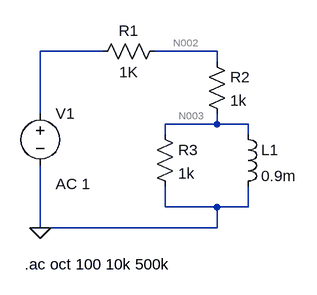
[diagram p0: schematic Draft1.asc]
Draft1.asc, the LTspice schematic file:
Version 4
SHEET 1 880 680
WIRE 80 96 -16 96
WIRE 256 96 160 96
WIRE 256 112 256 96
WIRE -16 192 -16 96
WIRE 256 208 256 192
WIRE 256 208 176 208
WIRE 304 208 256 208
WIRE 176 224 176 208
WIRE 304 224 304 208
WIRE 176 336 176 304
WIRE 256 336 176 336
WIRE 304 336 304 304
WIRE 304 336 256 336
WIRE -16 368 -16 272
WIRE 256 368 256 336
WIRE 256 368 -16 368
FLAG -16 368 0
SYMBOL res 64 112 R270
WINDOW 0 32 56 VTop 2
WINDOW 3 0 56 VBottom 2
SYMATTR InstName R1
SYMATTR Value 1K
SYMBOL res 240 96 R0
SYMATTR InstName R2
SYMATTR Value 1k
SYMBOL res 160 208 R0
SYMATTR InstName R3
SYMATTR Value 1k
SYMBOL ind 288 208 R0
SYMATTR InstName L1
SYMATTR Value 0.9m
SYMBOL voltage -16 176 R0
WINDOW 123 24 124 Left 2
WINDOW 39 0 0 Left 0
SYMATTR InstName V1
SYMATTR Value ""
SYMATTR Value2 AC 1
TEXT -40 424 Left 2 !.ac oct 100 10k 500k

The netlist it stands for:
* Draft1.asc
R1 N001 N002 1K
R2 N002 N003 1k
R3 N003 0 1k
L1 N003 0 0.9m
V1 N001 0 AC 1
.ac oct 100 10k 500k
.backanno
.end

* Results of the author's LTspice run, read from the files saved beside the schematic
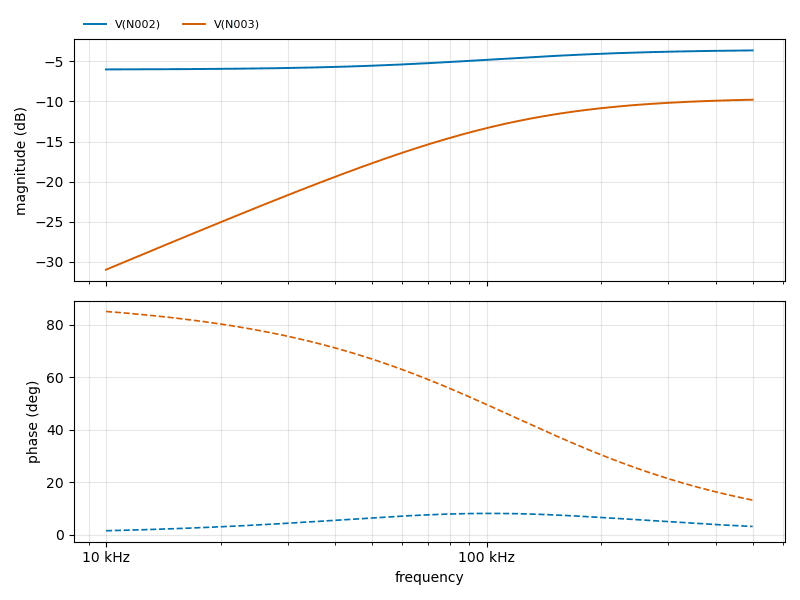
[diagram p1: AC Analysis of Draft1.asc, plotted from the saved traces]
* AC Analysis, 1 run:
*   V(N002): -6.00 dB at 10 kHz, -3.62 dB at 500 kHz, peak -3.62 dB at 500 kHz
*   V(N003): -31.00 dB at 10 kHz, -9.78 dB at 500 kHz, peak -9.78 dB at 500 kHz, 3 dB below the peak at 111.8 kHz